# Altium schematic sheet Buck+PM.SchDoc: 5V Regulator
size A4; Date: 08.04.2017; CheckedBy: CheckedBy; Author: Jan Petrik; CompanyName: FreeDSP; DrawnBy: Jan Petrik; Organization: FreeDSP; DocumentNumber: 4; Revision: B2; SheetNumber: 4; SheetTotal: 16; Version1: N/A; Version2: N/A; Version3: N/A; Change1description: N/A; Change2description: N/A; Change3description: N/A; Change1DrawnBy: N/A; Change2DrawnBy: N/A; Change3DrawnBy: N/A; Change1CheckedBy: N/A; Change2CheckedBy: N/A; Change3CheckedBy: N/A; PreviusVersion_Chng1: N/A; PreviusVersion_Chng2: N/A; PreviusVersion_Chng3: N/A; Variant1description: Standard assembly; Variant2description: N/A; Variant3description: N/A; Variant4description: N/A; email: jan_petrik@centrum.cz; license: CC BY-NC 4.0; DocumentName: Docname
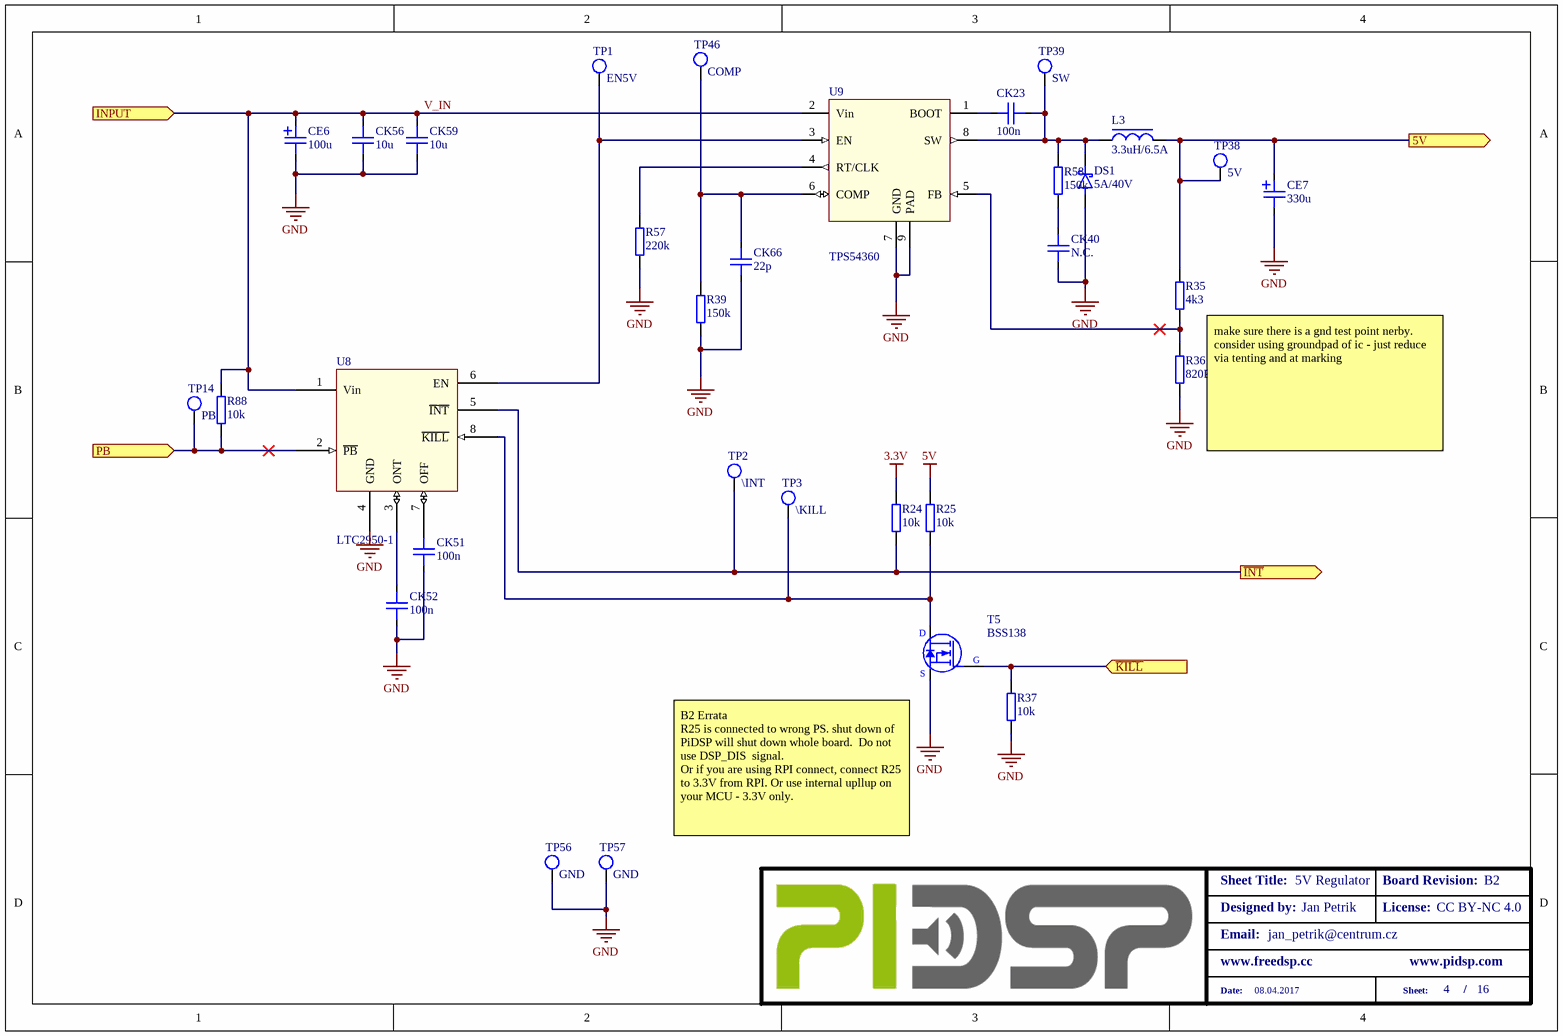
[diagram p0: Buck+PM.SchDoc]

## Parts
CE6  100u  [CAPAE6.8X6.8(D_SIZE)]
CE7  330u  [CAPAE6.8X6.8(D_SIZE)]
CK23  100n  [CAPC1608X09N(SMC0603)]
CK40  N.C.  [CAPC1608X09N(SMC0603)]
CK51  100n  [CAPC1608X09N(SMC0603)]
CK52  100n  [CAPC1608X09N(SMC0603)]
CK56  10u  [CAPC3216X12N(SMC1206)]
CK59  10u  [CAPC3216X12N(SMC1206)]
CK66  22p  [CAPC1608X09N(SMC0603)]
DS1  5A/40V  [DIOM6959X26M(SMC)]
L3  3.3uH/6.5A  [INDM_7.2x6.5]
R24  10k  [RESC1608X06N(SMR0603)]
R25  10k  [RESC1608X06N(SMR0603)]
R35  4k3  [RESC1608X06N(SMR0603)]
R36  820R  [RESC1608X06N(SMR0603)]
R37  10k  [RESC1608X06N(SMR0603)]
R39  150k  [RESC1608X06N(SMR0603)]
R57  220k  [RESC1608X06N(SMR0603)]
R58  150k  [RESC1608X06N(SMR0603)]
R88  10k  [RESC1608X06N(SMR0603)]
T5  BSS138  [SOT95P230X110-3N(SOT23)]
TP1  EN5V  [TP_0.8/0.4_ROUND]  (no BOM)
TP2  \INT  [TP_0.8/0.4_ROUND]  (no BOM)
TP3  \KILL  [TP_0.8/0.4_ROUND]  (no BOM)
TP14  PB  [TP_0.8/0.4_ROUND]  (no BOM)
TP38  5V  [TP_0.8/0.4_ROUND]  (no BOM)
TP39  SW  [TP_0.8/0.4_ROUND]  (no BOM)
TP46  COMP  [TP_0.8/0.4_ROUND]  (no BOM)
TP56  GND  [TP_0.8/0.4_ROUND]  (no BOM)
TP57  GND  [TP_0.8/0.4_ROUND]  (no BOM)
U8  LTC2950-1  [LT-TS8-8-TSOT-23_V]
U9  TPS54360  [SOIC127P600X175-8N(SOIC_8)-POWERPAD_HP]

## Ports
5V (out), INPUT (in), PB (in), ~{INT} (out), ~{KILL} (in)

## Nets
3.3V: R24.2
5V: R25.2
GND: CE6.2 CE7.2 CK40.2 CK51.2 CK52.2 CK56.2 CK59.2 CK66.1 DS1.2(A) R36.1 R37.1 R39.1 R57.1 T5.2(S) TP56.1 TP57.1 U8.4(GND) U9.7(GND) U9.9(PAD)
5V: CE7.1 L3.2 R35.2 TP38.1 ; port 5V  [a separate net that carries the same name]
~{INT}: R24.1 TP2.1 U8.5(~{INT}) ; port ~{INT}
~{KILL}: R37.2 T5.1(G) ; port ~{KILL}
PB: R88.1 TP14.1 U8.2(~{PB}) ; port PB
V_IN: CE6.1 CK56.1 CK59.1 R88.2 U8.1(Vin) U9.2(Vin) ; port INPUT
NetCK23_1: CK23.1 DS1.1(C) L3.1 R58.2 TP39.1 U9.8(SW)
NetCK23_2: CK23.2 U9.1(BOOT)
NetCK40_1: CK40.1 R58.1
NetCK51_1: CK51.1 U8.7(OFF)
NetCK52_1: CK52.1 U8.3(ONT)
NetCK66_2: CK66.2 R39.2 TP46.1 U9.6(COMP)
NetR25_1: R25.1 T5.3(D) TP3.1 U8.8(~{KILL})
NetR35_1: R35.1 R36.2 U9.5(FB)
NetR57_2: R57.2 U9.4(RT/CLK)
NetTP1_1: TP1.1 U8.6(EN) U9.3(EN)

## Notes on the sheet
- make sure there is a gnd test point nerby. consider using groundpad of ic - just reduce via tenting and at marking
- (near T5) B2 Errata
  R25 is connected to wrong PS. shut down of  PiDSP will shut down whole board.  Do not use DSP_DIS  signal.
  Or if you are using RPI connect, connect R25 to 3.3V from RPI. Or use internal upllup on your MCU - 3.3V only.
- Designed by:
- Sheet Title:
- Board Revision:
- License:
- Email:
- www.freedsp.cc
- www.pidsp.com
- Date:
- Sheet:
- /

## Library data of the parts
CE6 = 100u-16V-B6-OSCON: Polymer Aluminium Solid Capacitor 100uF, 16V; Mfg. Part Number: 875105344010; Signal Integrity: Cap; Tolerance: 20%/16V; Mfgr.: Wurth; Value: 100u; Package: D8H6.3; Simulation: Cap; Author: JP/27.03.2014; Voltage: 16V; Supplier 1: Mouser; Supplier Part Number 1: 710-875105344010
CE7 = 330u-6.3V-B6-OSCON: Polymer Aluminium Solid Capacitor 330uF, 6.3V; Signal Integrity: Cap; Tolerance: 20%/35V; Value: 330u; Package: D8H6.3; Simulation: Cap; Author: JP/27.03.2014; Voltage: 6.3V; Supplier 1: Mouser; Supplier Part Number 1: 710-875105144010; ClassName: DirectConnect
CK23 CK40 CK51 CK52 = 100n-50V-0603-X7R: MLCC; Signal Integrity: Cap; Voltage: 50V; Tolerance: 10%; Package: SMC2523; Simulation: Cap; Author: JP/27.03.2014; Supplier 1: Mouser; Supplier Part Number 1: 81-GRM39X104K50D
  CK23: Value: 100n; ClassName: DirectConnect
  CK40: Value: N.C.
  CK51 CK52: Value: 100n
CK56 CK59 = 10u-50V-1206-X5R: MLCC; Signal Integrity: Cap; Voltage: 50; Tolerance: 10%; Mfgr. PN: GRM31CR61H106MA2L; Mfgr.: Murata; Value: 10u; Package: SMC1206; Simulation: Cap; Author: JP/10.06.2014; Supplier 1: Mouser; Supplier Part Number 1: 81-GRM31CR61H106MA2L; ClassName: DirectConnect
CK66 = 22p-50V-0603-NP0: MLCC; Signal Integrity: Cap; Tolerance: 10%; Voltage: 50V; Value: 22p; Package: SMC0603; Simulation: Cap; Author: JP/27.03.2014; Supplier 1: Mouser; Supplier Part Number 1: 81-GCM1885C1H220J16D
DS1 = SSC54-E3: High Current Density SMT Schottky Rectifier, 5A/40V, SMC; Value: 5A/40V; Package: SMC; Supplier 1: Mouser; Supplier Part Number 1: 625-SSC54-E3; ClassName: DirectConnect
L3 = SRP6540_3.3u: SRP6540 Series - Shielded Power Inductors; SMD: 1; Value: 3.3uH/6.5A; Supplier 1: Mouser; Supplier Part Number 1: 652-SRP6540-3R3M; ClassName: DirectConnect
R24 R25 R37 R88 = 10k-100mW-0603-ThickFilm: Chip Resistor; Tolerance & Rating: 1%/0.1W; Signal Integrity: Res; Packare: SMR0603; Value: 10k; Simulation: Res; Author: JP/10.06.2014; SMD: 1; Supplier 1: Mouser; Supplier Part Number 1: 603-RC0603FR-0710KL; Type: Resistor
R35 = 4K3-100mW-0603-ThickFilm: Chip Resistor; Tolerance & Rating: 1%/0.1W; Signal Integrity: Res; Packare: SMR0603; Value: 4k3; Simulation: Res; Author: JP/10.06.2014; SMD: 1; Supplier 1: Mouser; Supplier Part Number 1: 603-RC0603FR-074K3L; Type: Resistor
R36 = 820R-100mW-0603-ThickFilm: Chip Resistor; Tolerance & Rating: 1%/0.1W; Signal Integrity: Res; Packare: SMR0603; Value: 820R; Simulation: Res; Author: JP/10.06.2014; SMD: 1; Supplier 1: Mouser; Supplier Part Number 1: 603-RC0603FR-07820RL; Type: Resistor
R39 R58 = 150k-100mW-0603-ThickFilm: Chip Resistor; Tolerance & Rating: 1%/0.1W; Signal Integrity: Res; Packare: SMR0603; Value: 150k; Simulation: Res; Author: JP/10.06.2014; SMD: 1; Supplier 1: Mouser; Supplier Part Number 1: 603-RC0603FR-07150KL; Type: Resistor
R57 = 220k-100mW-0603-ThickFilm: Chip Resistor; Tolerance & Rating: 1%/0.1W; Signal Integrity: Res; Packare: SMR0603; Value: 220k; Simulation: Res; Author: JP/10.06.2014; SMD: 1; Supplier 1: Mouser; Supplier Part Number 1: 603-RC0603FR-07220KL; Type: Resistor
T5 = ET+BSS138XX0: N-MOSFET, Logic Level, 50V/0,22A/3.5Ohm; Tolerance & Rating: 50 V/0,2 A/0,36 W; Author: JM 2.7.2014; SMD: 1; Value: BSS138; PN: BSS138; Supplier 1: Mouser; Supplier Part Number 1: 512-BSS138
TP1-TP3 TP14 TP38 TP39 TP46 TP56 TP57 = TEST_POINT_VIA: Testpoint - VIA; Value: 0.65/1.55; SMD: -; ClassName: TP
U8 = LTC2950-1: Pushbutton On/Off    Controller; Value: LTC2950-1; SMD: 1; Supplier 1: Farnell; Supplier Part Number 1: 2115908
U9 = TPS54360: 3.5 A, Step Down DC-DC Converter; Value: TPS54360; SMD: 1; Supplier 1: Mouser; Supplier Part Number 1: 595-TPS54360DDAR; ClassName: DirectConnect